# Altium schematic sheet NB3000_USB_Slideshow.SchDoc
size A; DocumentNumber: 1; SheetNumber: 1; SheetTotal: 1
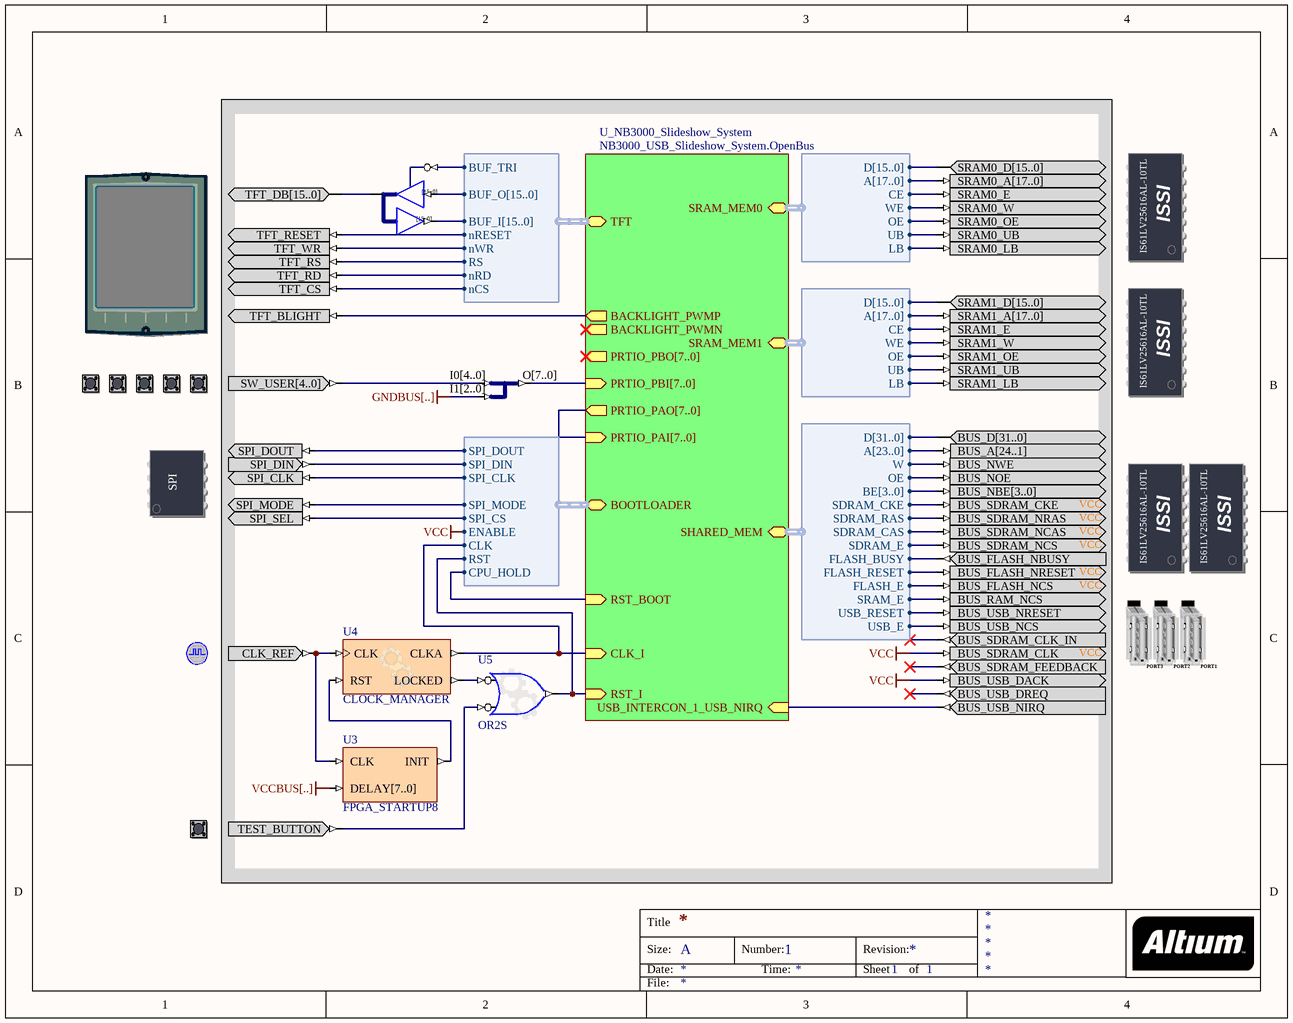
[diagram p0: NB3000_USB_Slideshow.SchDoc]

## Parts
(Parts that share a designator on the sheet are numbered #1, #2 ... from top to bottom, then left to right.)
?#1  SRAM0  (value not drawn)
?#2  TFT_LCD  (value not drawn)
?#3  SRAM1  (value not drawn)
?#4  USER_BUTTONS  (value not drawn)
?#5  SHARED_SRAM_USB  (value not drawn)
?#6  SERIALFMEMORY  (value not drawn)
?#7  CLOCK_REFERENCE  (value not drawn)
?#8  TEST_BUTTON  (value not drawn)
U1  IOBUF16B  (value not drawn)
U2  BUS_JS  (value not drawn)
U3  FPGA_STARTUP8
U4  CLOCK_MANAGER
U5  OR2S

## Sub-sheets
U_NB3000_Slideshow_System = NB3000_USB_Slideshow_System.OpenBus: CLK_I (in), RST_I (in), PRTIO_PBO[7..0] (out), PRTIO_PBI[7..0] (in), SRAM_MEM0 (harness WB_MEM_CTRL_SRAM16_A18), SRAM_MEM1 (harness WB_MEM_CTRL_SRAM16_A18), BACKLIGHT_PWMN (out), BACKLIGHT_PWMP (out), SHARED_MEM (harness WB_SHARED_MEM_CTRL), TFT (harness VGA32_ILI9320), USB_INTERCON_1_USB_NIRQ (in), BOOTLOADER (harness WB_BOOTLOADER), PRTIO_PAO[7..0] (out), PRTIO_PAI[7..0] (in), RST_BOOT (in)

## Harnesses
WB_MEM_CTRL_SRAM16_A18: D[15..0], A[17..0], CE, WE, OE, UB, LB
WB_SHARED_MEM_CTRL: D[31..0], A[23..0], W, OE, BE[3..0], SDRAM_CKE, SDRAM_RAS, SDRAM_CAS, SDRAM_E, FLASH_BUSY, FLASH_RESET, FLASH_E, SRAM_E, USB_RESET, USB_E
VGA32_ILI9320: BUF_TRI, BUF_O[15..0], BUF_I[15..0], nRESET, nWR, RS, nRD, nCS
WB_BOOTLOADER: SPI_DOUT, SPI_DIN, SPI_CLK, SPI_MODE, SPI_CS, CLK, RST, ENABLE, CPU_HOLD

## Nets
GNDBUS[..]: U2.I1[2..0]
VCC: ?#5.BUS_SDRAM_CLK ?#5.BUS_USB_DACK ; sheet U_NB3000_Slideshow_System/BOOTLOADER.ENABLE
VCCBUS[..]: U3.DELAY[7..0]
Net?#1_SRAM0_A[17..0]: ?#1.SRAM0_A[17..0] ; sheet U_NB3000_Slideshow_System/SRAM_MEM0.A[17..0]
Net?#1_SRAM0_D[15..0]: ?#1.SRAM0_D[15..0] ; sheet U_NB3000_Slideshow_System/SRAM_MEM0.D[15..0]
Net?#1_SRAM0_E: ?#1.SRAM0_E ; sheet U_NB3000_Slideshow_System/SRAM_MEM0.CE
Net?#1_SRAM0_LB: ?#1.SRAM0_LB ; sheet U_NB3000_Slideshow_System/SRAM_MEM0.LB
Net?#1_SRAM0_OE: ?#1.SRAM0_OE ; sheet U_NB3000_Slideshow_System/SRAM_MEM0.OE
Net?#1_SRAM0_UB: ?#1.SRAM0_UB ; sheet U_NB3000_Slideshow_System/SRAM_MEM0.UB
Net?#1_SRAM0_W: ?#1.SRAM0_W ; sheet U_NB3000_Slideshow_System/SRAM_MEM0.WE
Net?#2_TFT_BLIGHT: ?#2.TFT_BLIGHT ; sheet U_NB3000_Slideshow_System/BACKLIGHT_PWMP
Net?#2_TFT_CS: ?#2.TFT_CS ; sheet U_NB3000_Slideshow_System/TFT.nCS
Net?#2_TFT_DB[15..0]: ?#2.TFT_DB[15..0] U1.IO[15..0]
Net?#2_TFT_RD: ?#2.TFT_RD ; sheet U_NB3000_Slideshow_System/TFT.nRD
Net?#2_TFT_RESET: ?#2.TFT_RESET ; sheet U_NB3000_Slideshow_System/TFT.nRESET
Net?#2_TFT_RS: ?#2.TFT_RS ; sheet U_NB3000_Slideshow_System/TFT.RS
Net?#2_TFT_WR: ?#2.TFT_WR ; sheet U_NB3000_Slideshow_System/TFT.nWR
Net?#3_SRAM1_A[17..0]: ?#3.SRAM1_A[17..0] ; sheet U_NB3000_Slideshow_System/SRAM_MEM1.A[17..0]
Net?#3_SRAM1_D[15..0]: ?#3.SRAM1_D[15..0] ; sheet U_NB3000_Slideshow_System/SRAM_MEM1.D[15..0]
Net?#3_SRAM1_E: ?#3.SRAM1_E ; sheet U_NB3000_Slideshow_System/SRAM_MEM1.CE
Net?#3_SRAM1_LB: ?#3.SRAM1_LB ; sheet U_NB3000_Slideshow_System/SRAM_MEM1.LB
Net?#3_SRAM1_OE: ?#3.SRAM1_OE ; sheet U_NB3000_Slideshow_System/SRAM_MEM1.OE
Net?#3_SRAM1_UB: ?#3.SRAM1_UB ; sheet U_NB3000_Slideshow_System/SRAM_MEM1.UB
Net?#3_SRAM1_W: ?#3.SRAM1_W ; sheet U_NB3000_Slideshow_System/SRAM_MEM1.WE
Net?#4_SW_USER[4..0]: ?#4.SW_USER[4..0] U2.I0[4..0]
Net?#5_BUS_A[24..1]: ?#5.BUS_A[24..1] ; sheet U_NB3000_Slideshow_System/SHARED_MEM.A[23..0]
Net?#5_BUS_D[31..0]: ?#5.BUS_D[31..0] ; sheet U_NB3000_Slideshow_System/SHARED_MEM.D[31..0]
Net?#5_BUS_FLASH_NBUSY: ?#5.BUS_FLASH_NBUSY ; sheet U_NB3000_Slideshow_System/SHARED_MEM.FLASH_BUSY
Net?#5_BUS_FLASH_NCS: ?#5.BUS_FLASH_NCS ; sheet U_NB3000_Slideshow_System/SHARED_MEM.FLASH_E
Net?#5_BUS_FLASH_NRESET: ?#5.BUS_FLASH_NRESET ; sheet U_NB3000_Slideshow_System/SHARED_MEM.FLASH_RESET
Net?#5_BUS_NBE[3..0]: ?#5.BUS_NBE[3..0] ; sheet U_NB3000_Slideshow_System/SHARED_MEM.BE[3..0]
Net?#5_BUS_NOE: ?#5.BUS_NOE ; sheet U_NB3000_Slideshow_System/SHARED_MEM.OE
Net?#5_BUS_NWE: ?#5.BUS_NWE ; sheet U_NB3000_Slideshow_System/SHARED_MEM.W
Net?#5_BUS_RAM_NCS: ?#5.BUS_RAM_NCS ; sheet U_NB3000_Slideshow_System/SHARED_MEM.SRAM_E
Net?#5_BUS_SDRAM_CKE: ?#5.BUS_SDRAM_CKE ; sheet U_NB3000_Slideshow_System/SHARED_MEM.SDRAM_CKE
Net?#5_BUS_SDRAM_NCAS: ?#5.BUS_SDRAM_NCAS ; sheet U_NB3000_Slideshow_System/SHARED_MEM.SDRAM_CAS
Net?#5_BUS_SDRAM_NCS: ?#5.BUS_SDRAM_NCS ; sheet U_NB3000_Slideshow_System/SHARED_MEM.SDRAM_E
Net?#5_BUS_SDRAM_NRAS: ?#5.BUS_SDRAM_NRAS ; sheet U_NB3000_Slideshow_System/SHARED_MEM.SDRAM_RAS
Net?#5_BUS_USB_NCS: ?#5.BUS_USB_NCS ; sheet U_NB3000_Slideshow_System/SHARED_MEM.USB_E
Net?#5_BUS_USB_NIRQ: ?#5.BUS_USB_NIRQ ; sheet U_NB3000_Slideshow_System/USB_INTERCON_1_USB_NIRQ
Net?#5_BUS_USB_NRESET: ?#5.BUS_USB_NRESET ; sheet U_NB3000_Slideshow_System/SHARED_MEM.USB_RESET
Net?#6_SPI_CLK: ?#6.SPI_CLK ; sheet U_NB3000_Slideshow_System/BOOTLOADER.SPI_CLK
Net?#6_SPI_DIN: ?#6.SPI_DIN ; sheet U_NB3000_Slideshow_System/BOOTLOADER.SPI_DIN
Net?#6_SPI_DOUT: ?#6.SPI_DOUT ; sheet U_NB3000_Slideshow_System/BOOTLOADER.SPI_DOUT
Net?#6_SPI_MODE: ?#6.SPI_MODE ; sheet U_NB3000_Slideshow_System/BOOTLOADER.SPI_MODE
Net?#6_SPI_SEL: ?#6.SPI_SEL ; sheet U_NB3000_Slideshow_System/BOOTLOADER.SPI_CS
Net?#7_CLK_REF: ?#7.CLK_REF U3.CLK U4.CLK
Net?#8_TEST_BUTTON: ?#8.TEST_BUTTON U5.I1
NetU1_I[15..0]: U1.I[15..0] ; sheet U_NB3000_Slideshow_System/TFT.BUF_O[15..0]
NetU1_O[15..0]: U1.O[15..0] ; sheet U_NB3000_Slideshow_System/TFT.BUF_I[15..0]
NetU1_T: U1.T ; sheet U_NB3000_Slideshow_System/TFT.BUF_TRI
NetU2_O[7..0]: U2.O[7..0] ; sheet U_NB3000_Slideshow_System/PRTIO_PBI[7..0]
NetU3_INIT: U3.INIT U4.RST
NetU4_CLKA: U4.CLKA ; sheet U_NB3000_Slideshow_System/CLK_I, sheet U_NB3000_Slideshow_System/BOOTLOADER.CLK
NetU4_LOCKED: U4.LOCKED U5.I0
NetU5_O: U5.O ; sheet U_NB3000_Slideshow_System/RST_I, sheet U_NB3000_Slideshow_System/BOOTLOADER.RST
(unnamed): sheet U_NB3000_Slideshow_System/RST_BOOT, sheet U_NB3000_Slideshow_System/BOOTLOADER.CPU_HOLD

Not connected (* = marked no-connect by the designer): ?#5 BUS_SDRAM_CLK_IN* BUS_SDRAM_FEEDBACK* BUS_USB_DREQ*

## Buses and harness runs
bus sheet U_NB3000_Slideshow_System/PRTIO_PAI[7..0] = sheet U_NB3000_Slideshow_System/PRTIO_PAO[7..0]

## Notes on the sheet
- Title
- Size:
- Date:
- A
- Number:
- Time:
- Revision:
- Sheet
- of
- File:
- (in symbol IOBUF16B) [15..0]
- (in symbol SHARED_SRAM_USB) VCC; ISSI; IS61LV25616AL-10TL; USB2; PORT3; PORT2; PORT1
- (in symbol SPI_BUS) SPI
- (in symbol SRAM0) ISSI; IS61LV25616AL-10TL
- (in symbol SRAM1) ISSI; IS61LV25616AL-10TL

## Library data of the parts
?#1 = SRAM0: Free Static RAM - Daughterboard; PortComponent: True; Published: 14-May-2007; Publisher: Altium Limited; HelpURL: https://wiki.altium.com/display/ADOH/NanoBoard+3000+-+Independent+SRAM
?#2 = TFT_LCD: TFT LCD Panel; PortComponent: True; Published: 22-Jan-2007; Publisher: Altium Limited; HelpURL: TR0143 Technical Reference Manual for Altium's Desktop NanoBoard NB2DSK01.pdf#page=50
?#3 = SRAM1: Free Static RAM - Daughterboard; PortComponent: True; Published: 14-May-2007; Publisher: Altium Limited; HelpURL: https://wiki.altium.com/display/ADOH/NanoBoard+3000+-+Independent+SRAM
?#4 = USER_BUTTONS: Generic User Buttons; PortComponent: True; Published: 16-Apr-2007; Publisher: Altium Limited; HelpURL: TR0143 Technical Reference Manual for Altium's Desktop NanoBoard NB2DSK01.pdf#page=53
?#5 = SHARED_SRAM_USB: Common-Bus SRAM and USB; PortComponent: True; Published: 14-May-2007; Publisher: Altium Limited; HelpURL: https://wiki.altium.com/display/ADOH/Accessing+Common-Bus+Resources+on+the+NanoBoard+3000
?#6 = SPI_BUS: Serial SPI Flash RAM; PortComponent: True; Published: 19-Nov-2003; Publisher: Altium Limited; HelpURL: https://wiki.altium.com/display/ADOH/Using+Multiple+SPI+and+I2C+Devices+in+a+Design; UseInDSF: True
?#7 = CLOCK_REFERENCE: Global System Clock Reference Supply; PortComponent: True; Published: 19-Nov-2003; Publisher: Altium Limited; HelpURL: TR0143 Technical Reference Manual for Altium's Desktop NanoBoard NB2DSK01.pdf#page=41
?#8 = TEST_BUTTON: Test / Reset Button; PortComponent: True; Published: 19-Nov-2003; Publisher: Altium Limited; HelpURL: TR0143 Technical Reference Manual for Altium's Desktop NanoBoard NB2DSK01.pdf#page=53
U1 = IOBUF16B: 16-Bit Input/Output Buffer, Bus Version; SubClass: IOBUF; Enable: Low; Control: Common Control T; PortSize: 16; ArchiveName: GENERIC; VHDLIB_SIM: GENERIC_LIB; Published: 29-Jan-2004; Publisher: Altium Limited; LastRevisionNo: 1.00.00; HelpURL: CR0118 FPGA Generic Library Guide.pdf#page=293; ComponentLink1URL: CR0125 FPGA Buffer Resource Usage.pdf#page=91; ComponentLink1Description: Core &Resource Usage; FunctionalClass: Buffer; PortStyle: Bus Version
U2 = BUS_JS: Configurable Bus Joiner/Splitter; ConfiguratorName: GENERIC_BUS_JS; ConfigurationParameters: {}Version[1.0]{}SplitterJoinerType[Joiner]{}SignalCount[2]{}SignalWidth0[5]{}SignalWidth1[3]{}; LastRevisionNo: 1.00.00; Published: 17-Sep-2008; Publisher: Altium Limited
U3 = FPGA_STARTUP8: FPGA Startup With 8 Bit Delay; Published: 9-Dec-2004; Publisher: Altium Limited; HelpURL: CR0119 FPGA_STARTUPx Powerup Delay Unit.pdf; LastRevisionNo: 1.00.00; ComponentLink1Description: Core &Resource Usage; ComponentLink1URL: CR0139 FPGA Peripheral Resource Usage.pdf#page=11
U4 = CLOCKMANAGER: Configurable Clock Manager; ConfiguratorName: GENERIC_CLOCKMANAGER; ConfigurationParameters: {}Version[1.1]{}Option_Configuration[object TClockManagerPersist / VersionMajor [ 0 / VersionMinor [ 0 / InputFreq [ 20.000000000000000000 / InputName [ 'CLK' / OutputTargets [ < / item / Name [ 'CLKA' / OutFreqMin [ 50.000000000000000000 / OutFreqMax [ 50.000000000000000000 / OutPostDivider [ 1.000000000000000000 / end> / OutputDevices [ < / item / Name [ 'Spartan3AN' / Valid [ True / OutputActuals [ < / item / Name [ 'CLK0' / Multipler [ 1.000000000000000000 / Divider [ 1.000000000000000000 / OutFreq [ 20.000000000000000000 / OutputMap [ 1 / end / item / Name [ 'CLK90' / Multipler [ 1.000000000000000000 / Divider [ 1.000000000000000000 / OutPhase [ 90.000000000000000000 / OutFreq [ 20.000000000000000000 / OutputMap [ 2 / end / item / Name [ 'CLK180' / Multipler [ 1.000000000000000000 / Divider [ 1.000000000000000000 / OutPhase [ 180.000000000000000000 / OutFreq [ 20.000000000000000000 / OutputMap [ 3 / end / item / Name [ 'CLK270' / Multipler [ 1.000000000000000000 / Divider [ 1.000000000000000000 / OutPhase [ 270.000000000000000000 / OutFreq [ 20.000000000000000000 / OutputMap [ 4 / end / item / Name [ 'CLK2X' / Multipler [ 2.000000000000000000 / Divider [ 1.000000000000000000 / OutFreq [ 40.000000000000000000 / OutputMap [ 5 / end / item / Name [ 'CLKDV' / Multipler [ 1.000000000000000000 / Divider [ 16.000000000000000000 / OutFreq [ 1.250000000000000000 / OutputMap [ 6 / end / item / Name [ 'CLK2X180' / Multipler [ 1.000000000000000000 / Divider [ 1.000000000000000000 / OutPhase [ 180.000000000000000000 / OutFreq [ 40.000000000000000000 / OutputMap [ 7 / end / item / Name [ 'CLKFX' / Multipler [ 5.000000000000000000 / Divider [ 2.000000000000000000 / OutFreq [ 50.000000000000000000 / OutputMap [ 0 / end / item / Name [ 'CLKFX180' / Multipler [ 1.000000000000000000 / Divider [ 1.000000000000000000 / OutPhase [ 180.000000000000000000 / OutFreq [ 50.000000000000000000 / OutputMap [ 8 / end> / InternalActuals [ <> / CustomVars [ <> / end / item / Name [ 'Cyclone3' / Valid [ True / OutputActuals [ < / item / Name [ 'C0' / Multipler [ 5.000000000000000000 / Divider [ 2.000000000000000000 / OutFreq [ 50.000000000000000000 / OutputMap [ 0 / end / item / Name [ 'C1' / Multipler [ 1.000000000000000000 / Divider [ 1.000000000000000000 / OutFreq [ 20.000000000000000000 / OutputMap [ 1 / end / item / Name [ 'C2' / Multipler [ 1.000000000000000000 / Divider [ 1.000000000000000000 / OutFreq [ 20.000000000000000000 / OutputMap [ 2 / end / item / Name [ 'C3' / Multipler [ 1.000000000000000000 / Divider [ 1.000000000000000000 / OutFreq [ 20.000000000000000000 / OutputMap [ 3 / end / item / Name [ 'C4' / Multipler [ 1.000000000000000000 / Divider [ 1.000000000000000000 / OutFreq [ 20.000000000000000000 / OutputMap [ 4 / end> / InternalActuals [ <> / CustomVars [ <> / end> / MinInputFreq [ 5.000000000000000000 / MaxInputFreq [ 280.000000000000000000 / MinOutputFreq [ 18.000000000000000000 / MaxOutputFreq [ 210.000000000000000000 / MaxOutputCount [ 5 / end]{}; LastRevisionNo: 1.00.00; Published: 18-Feb-2009; Publisher: Altium Limited
U5 = GATE: Configurable Generic Gate; ConfiguratorName: GENERIC_GATE; ConfigurationParameters: {}Version[1.1]{}GateKind[OR]{}BusInput[False]{}GateInputType[Bit]{}GateOutputOption[Normal]{}BusWidth[8]{}RegisterOutputs[False]{}NegativeClockEdge[False]{}InputCount[2]{}InputInvert0[True]{}InputInvert1[True]{}; LastRevisionNo: 1.00.00; Published: 3-Sep-2008; Publisher: Altium Limited